# Altium project sensores_0v2.PrjPcb
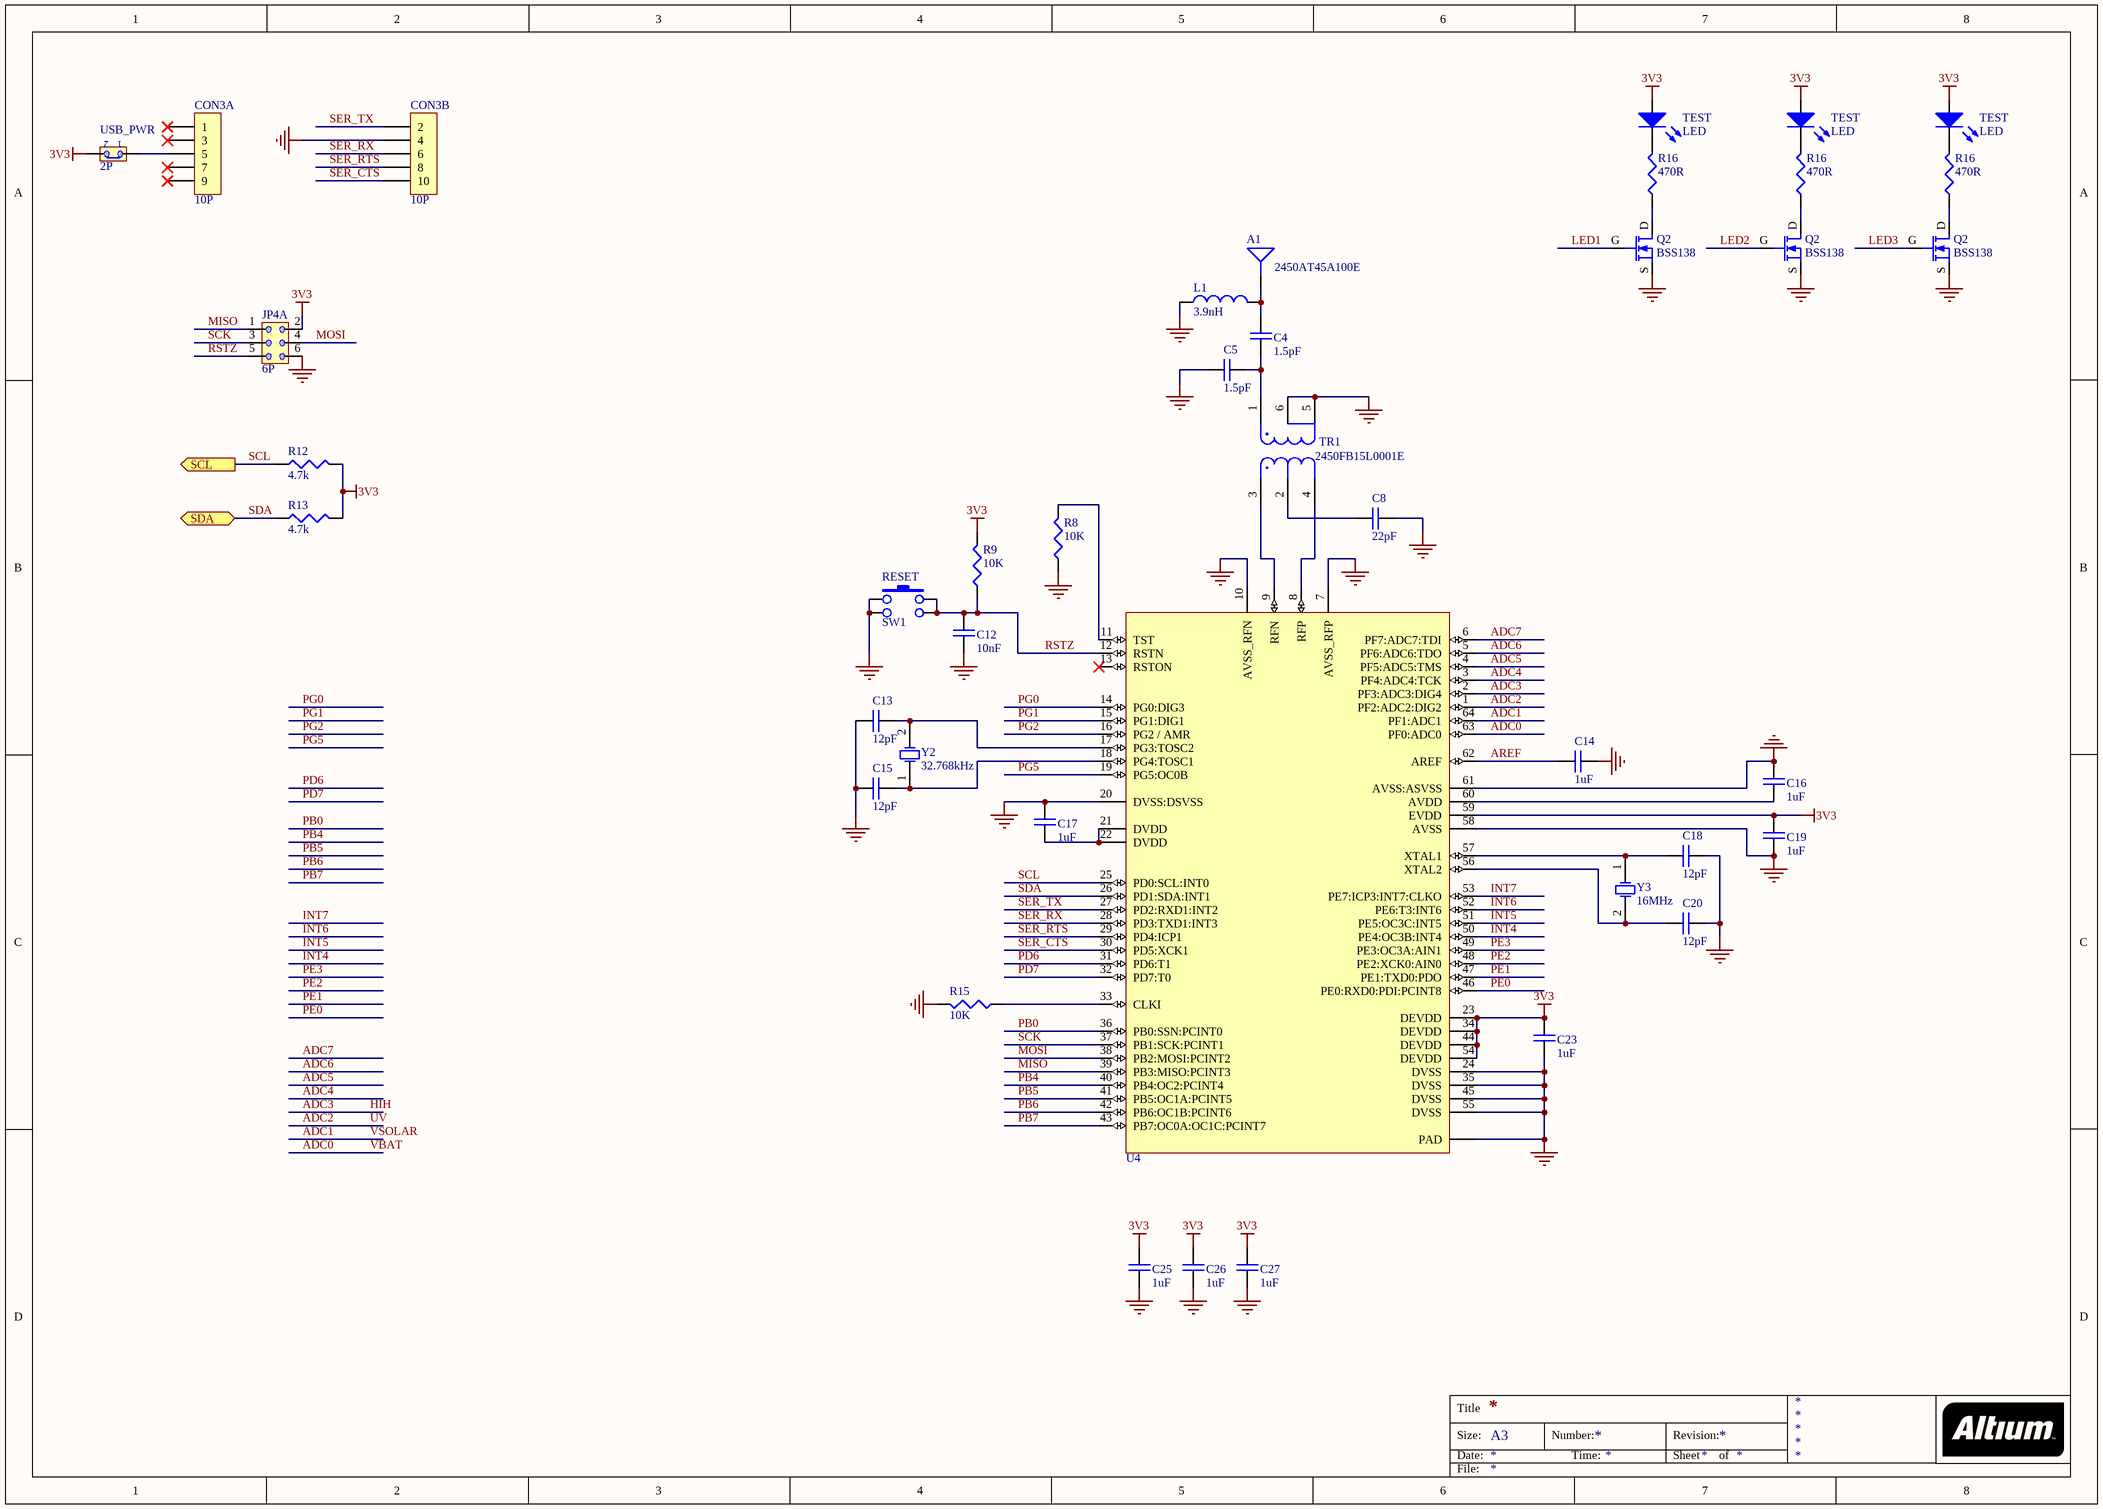
[diagram p0: atmega128rf.SchDoc]
1 sheet, 40 parts. Net scope: flat (ports and power ports of the same name join across sheets).

## Sheet atmega128rf.SchDoc
size A3

### Parts
(Parts that share a designator on the sheet are numbered #1, #2 ... from top to bottom, then left to right.)
A1  2450AT45A100E  [2450AT45A100E]
C4  1.5pF  [0402]
C5  1.5pF  [0402]
C8  22pF  [0402]
C12  10nF  [0603]
C13  12pF  [0603]
C14  1uF  [0603]
C15  12pF  [0603]
C16  1uF  [0603]
C17  1uF  [0603]
C18  12pF  [0603]
C19  1uF  [0603]
C20  12pF  [0603]
C23  1uF  [0603]
C25  1uF  [0603]
C26  1uF  [0603]
C27  1uF  [0603]
CON3  10P  [IDC-10-90]  (parts A,B of 2)
JP4  6P  [DIL-6]  (part A of 3)
L1  3.9nH  [0402]
Q2#1  BSS138  [SOT-23@GSD]
Q2#2  BSS138  [SOT-23@GSD]
Q2#3  BSS138  [SOT-23@GSD]
R8  10K  [0603]
R9  10K  [0603]
R12  4.7k  [0603]
R13  4.7k  [0603]
R15  10K  [0603]
R16#1  470R  [0603]
R16#2  470R  [0603]
R16#3  470R  [0603]
RESET  SW1  [MICROSWITCH]
TEST#1  LED  [0805@DIODE]
TEST#2  LED  [0805@DIODE]
TEST#3  LED  [0805@DIODE]
TR1  2450FB15L0001E  [0805@BALUN]
U4  ATmega128RFA1  [QFN-64@EP]  (value not drawn)
USB_PWR  2P  [SIP-2]
Y2  32.768kHz  [HC-49U]
Y3  16MHz  [HC-49U]

### Ports
SCL (out), SDA (bidir)

### Nets
3V3: C19.2 C23.2 C25.2 C26.2 C27.2 JP4.2 R9.2 R12.2 R13.2 TEST#1.A TEST#2.A TEST#3.A U4.23(DEVDD) U4.34(DEVDD) U4.44(DEVDD) U4.54(DEVDD) U4.59(EVDD) USB_PWR.2
GND: C5.1 C8.2 C12.2 C13.1 C14.1 C15.1 C16.2 C17.2 C18.2 C19.1 C20.2 C23.1 C25.1 C26.1 C27.1 CON3.4 JP4.6 L1.1 Q2#1.S Q2#2.S Q2#3.S R8.1 R15.2 RESET.1 RESET.3 TR1.5(Ground) TR1.6(Ground) U4.7(AVSS_RFP) U4.10(AVSS_RFN) U4.20(DVSS:DSVSS) U4.24(DVSS) U4.35(DVSS) U4.45(DVSS) U4.55(DVSS) U4.58(AVSS) U4.61(AVSS:ASVSS) U4.PAD
ADC0: U4.63(PF0:ADC0)  [also labelled VBAT]
ADC1: U4.64(PF1:ADC1)  [also labelled VSOLAR]
ADC2: U4.1(PF2:ADC2:DIG2)  [also labelled UV]
ADC3: U4.2(PF3:ADC3:DIG4)  [also labelled HIH]
ADC4: U4.3(PF4:ADC4:TCK)
ADC5: U4.4(PF5:ADC5:TMS)
ADC6: U4.5(PF6:ADC6:TDO)
ADC7: U4.6(PF7:ADC7:TDI)
AREF: C14.2 U4.62(AREF)
INT4: U4.50(PE4:OC3B:INT4)
INT5: U4.51(PE5:OC3C:INT5)
INT6: U4.52(PE6:T3:INT6)
INT7: U4.53(PE7:ICP3:INT7:CLKO)
LED1: Q2#1.G
LED2: Q2#2.G
LED3: Q2#3.G
MISO: JP4.1 U4.39(PB3:MISO:PCINT3)
MOSI: JP4.4 U4.38(PB2:MOSI:PCINT2)
PB0: U4.36(PB0:SSN:PCINT0)
PB4: U4.40(PB4:OC2:PCINT4)
PB5: U4.41(PB5:OC1A:PCINT5)
PB6: U4.42(PB6:OC1B:PCINT6)
PB7: U4.43(PB7:OC0A:OC1C:PCINT7)
PD6: U4.31(PD6:T1)
PD7: U4.32(PD7:T0)
PE0: U4.46(PE0:RXD0:PDI:PCINT8)
PE1: U4.47(PE1:TXD0:PDO)
PE2: U4.48(PE2:XCK0:AIN0)
PE3: U4.49(PE3:OC3A:AIN1)
PG0: U4.14(PG0:DIG3)
PG1: U4.15(PG1:DIG1)
PG2: U4.16(PG2_/_AMR)
PG5: U4.19(PG5:OC0B)
RSTZ: C12.1 JP4.5 R9.1 RESET.2 RESET.4 U4.12(RSTN)
SCK: JP4.3 U4.37(PB1:SCK:PCINT1)
SCL: R12.1 U4.25(PD0:SCL:INT0) ; port SCL
SDA: R13.1 U4.26(PD1:SDA:INT1) ; port SDA
SER_CTS: CON3.10 U4.30(PD5:XCK1)
SER_RTS: CON3.8 U4.29(PD4:ICP1)
SER_RX: CON3.6 U4.28(PD3:TXD1:INT3)
SER_TX: CON3.2 U4.27(PD2:RXD1:INT2)
NetA1_1: A1.1 C4.2 L1.2
NetC4_1: C4.1 C5.2 TR1.1(Unbalanced_Port)
NetC8_1: C8.1 TR1.2(DC_Feed_+_RF_GND)
NetC13_2: C13.2 U4.17(PG3:TOSC2) Y2.2(OSC2)
NetC15_2: C15.2 U4.18(PG4:TOSC1) Y2.1(OSC1)
NetC16_1: C16.1 U4.60(AVDD)
NetC17_1: C17.1 U4.21(DVDD) U4.22(DVDD)
NetC18_1: C18.1 U4.57(XTAL1) Y3.1(OSC1)
NetC20_1: C20.1 U4.56(XTAL2) Y3.2(OSC2)
NetCON3_5: CON3.5 USB_PWR.1
NetQ2#1_D: Q2#1.D R16#1.1
NetQ2#2_D: Q2#2.D R16#2.1
NetQ2#3_D: Q2#3.D R16#3.1
NetR8_2: R8.2 U4.11(TST)
NetR15_1: R15.1 U4.33(CLKI)
NetR16#1_2: R16#1.2 TEST#1.K
NetR16#2_2: R16#2.2 TEST#2.K
NetR16#3_2: R16#3.2 TEST#3.K
NetTR1_3: TR1.3(Balanced_Port) U4.9(RFN)
NetTR1_4: TR1.4(Balanced_Port) U4.8(RFP)

Not connected (* = marked no-connect by the designer): CON3 1* 3* 7* 9*; U4 13(RSTON)*

### Notes on the sheet
- Title
- Size:
- Date:
- A3
- Number:
- Time:
- Revision:
- Sheet
- of
- File:

### Library data of the parts
A1 = Antenna SE: ANTENNA
C4 C5 C8 C12-C20 C23 C25-C27 = CAP: Capacitor; Owner: Nuno Brum; Sub-Type: Ceramic; Assembly: INS; Maximum Voltage: *; Creation Date: 2005-04-28; Status: Valid; Validation date: 2006-05-15; Type: Capacitor
CON3 = CON10: Connector 10 Pins; Owner: António Silva; Assembly: INS; Sub-Type: Connector; Creation Date: 2005-11-21; Status: Valid; Validation Date: 2006-05-15; Type: Electrical & Mechanical
JP4 = JMP6: 6-Pin Jumper; Sub-Type: Connector; Owner: Rui Rebelo; Assembly: INS; Creation Date: 2005-07-17; Status: Valid; Validation Date: 2006-05-15; Type: Electrical & Mechanical
L1 = IND: Inductor; Owner: Nuno Brum; Sub-Type: Generic; Assembly: INS; Validation date: 2006-05-15; Creation Date: 2002-07-17; Status: Valid; Type: Inductor
Q2#1-Q2#3 = MOSFET-N: N-Channel Logic Level Enhancement Mode Field Effect Transistor; pin to pad: 2>3 3>2; Owner: Nuno Brum; Sub-Type: MOSFET; Assembly: INS; Creation Date: 2001-06-05; Status: Valid; Model: BSS138; Type: Transistor
R8 R9 R12 R13 R15 R16#1-R16#3 = RES: Resistor; Owner: Nuno Brum; Sub-Type: Generic; Assembly: INS; Validation date: 2006-05-15; Creation Date: 2002-07-17; Status: Valid; Power: *; Type: Resistor
RESET = SW1: Switch Push Button; Owner: Nuno Brum; Assembly: INS; Validation Date: 2006-05-15; Sub-Type: Switch; Creation Date: 2002-07-17; Status: Valid; Type: Electrical & Mechanical
TEST#1-TEST#3 = LED: Light emitting diode; Owner: Nuno Brum; Assembly: INS; Creation Date: 2001-06-05; Sub-Type: LED; Status: Valid; Validation date: 2006-05-15; Model: LED; Type: Diode
TR1 = 2450FB15L0001E: FILTER BALUN ATMEL 2.45GHZ; Owner: Rui Rebelo; Sub-Type: Transformer; Type: Electrical & Mechanical; Assembly: INS; Creation Date: 2002-07-25; Status: New
U4 = ATmega128RFA1: 802.15.4 compliant AVR transceiver; verified by: vlarsen; verified date: 2010-12-05; Status: Verified
USB_PWR = JMP2: 2-pin Jumper; Owner: Nuno Brum; Sub-Type: Connector; STATE1: 1; Assembly: INS; Validation Date: 2006-05-15; Creation Date: 2002-07-17; Status: Valid; Type: Electrical & Mechanical
Y2 Y3 = Crystal Oscillator: Published: 17-Jul-2002; DatasheetDocument: 18-Apr-2000; PackageReference: CSM-7; Publisher: Altium Limited; ComponentLink1Description: Manufacturer Link; ComponentLink1URL: http://www.ecsxtal.com/; ComponentLink2Description: Datasheet; ComponentLink2URL: http://www.ecsxtal.com/pdf3/CSM_7.pdf